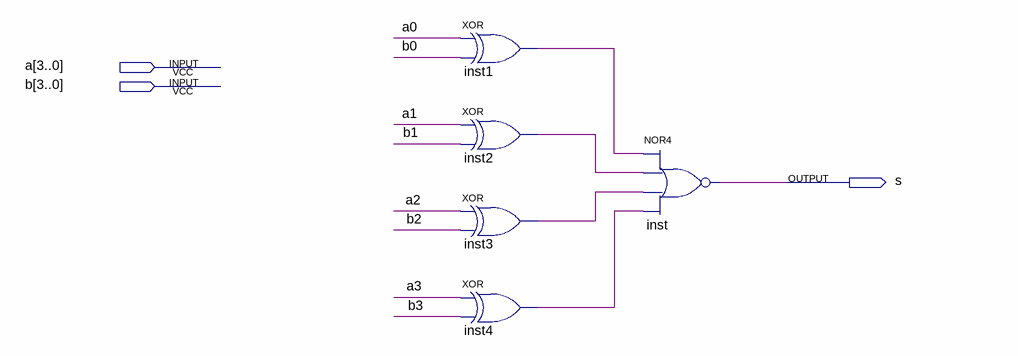
[diagram p0: schematic sheet]
// Quartus schematic comparador.bdf as structural Verilog: 5 symbols, 3 pins
module comparador (
  input  [3:0] a,
  input  [3:0] b,
  output s
);

  wire inst1_out, inst2_out, inst3_out, inst4_out;

  xor inst1 (inst1_out, a[0], b[0]);
  xor inst2 (inst2_out, a[1], b[1]);
  xor inst3 (inst3_out, a[2], b[2]);
  xor inst4 (inst4_out, a[3], b[3]);
  nor inst (s, inst1_out, inst2_out, inst3_out, inst4_out);
endmodule
